# Altium project Radio Messenger.PrjPcb
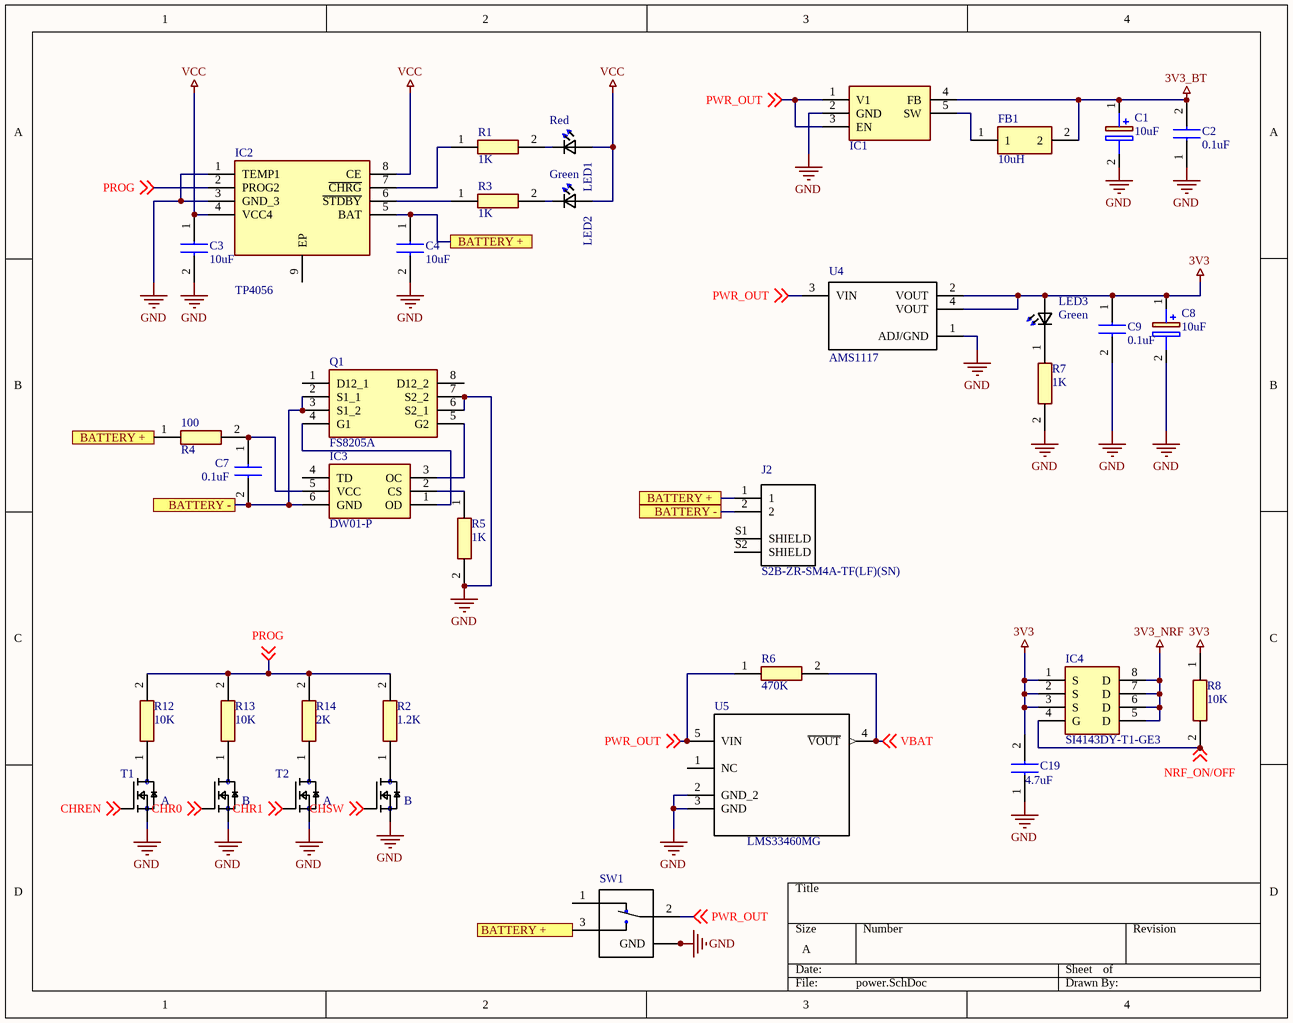
[diagram p0: power.SchDoc]
2 sheets, 51 parts. Net scope: flat (ports and power ports of the same name join across sheets).
Board file: Radio PCB.PcbDoc
Sheets:
  power.SchDoc
  Radio.SchDoc

## Sheet power.SchDoc: Power Schematic
size A; DrawnBy: Pramod Sandaruwan; DocumentNumber: 1; Revision: V3; SheetNumber: 1; SheetTotal: 5

### Parts
C1  value 10uF  [CAPPM3216X180N]  (hidden comment: tantalum capacitor 1206)
C2  value 0.1uF  [*CAPC1608X95N]  (hidden comment: capacitor 0603)
C3  value 10uF  [CAPC2012X94N]  (hidden comment: 08055A101JAT2A)
C4  value 10uF  [CAPC2012X94N]  (hidden comment: 08055A101JAT2A)
C7  value 0.1uF  [CAPC2012X94N]  (hidden comment: 08055A101JAT2A)
C8  value 10uF  [CAPPM3216X180N]  (hidden comment: tantalum capacitor 1206)
C9  value 0.1uF  [*CAPC1608X95N]  (hidden comment: capacitor 0603)
C19  value 4.7uF  [CAPC2012X94N]  (hidden comment: 08055A101JAT2A)
FB1  value 10uH  [BEADC1608X95N]  (hidden comment: inductor 0603)
IC1  TPS62203  [SOT95P280X145-5N]  (value not drawn)
IC2  TP4056  [SOIC127P600X175-9N]
IC3  DW01-P  [SOT95P280X135-6N]
IC4  SI4143DY-T1-GE3  [SI4143DY-T1-GE3]
J2  S2B-ZR-SM4A-TF(LF)(SN)  [*JST_S2B-ZR-SM4A-TF(LF)(SN)_S2B-ZR-SM4A-TF(LF)(SN)(Primary)]
LED1  value Red  [*0603]  (hidden comment: HSMR-C191)
LED2  value Green  [*0603]  (hidden comment: HSMR-C191)
LED3  value Green  [*0603]  (hidden comment: HSMR-C191)
Q1  FS8205A  [SOP65P640X120-8N]
R1  value 1K  [RESC1608X55N]  (hidden comment: resistor)
R2  value 1.2K  [RESC1608X55N]  (hidden comment: resistor)
R3  value 1K  [RESC1608X55N]  (hidden comment: resistor)
R4  value 100  [RESC2012X65N]  (hidden comment: CPF0805)
R5  value 1K  [RESC2012X65N]  (hidden comment: CPF0805)
R6  value 470K  [RESC1608X55N]  (hidden comment: resistor)
R7  value 1K  [RESC1608X55N]  (hidden comment: resistor)
R8  value 10K  [RESC2012X65N]  (hidden comment: CPF0805)
R12  value 10K  [RESC1608X55N]  (hidden comment: resistor)
R13  value 10K  [RESC1608X55N]  (hidden comment: resistor)
R14  value 2K  [RESC1608X55N]  (hidden comment: resistor)
SW1  1437575-1  [*SW_MLL1200S_MLL1200S(Primary)]  (value not drawn)
T1  PMGD780SN  [*SOP65P210X110-6N]  (value not drawn)
T2  PMGD780SN  [*SOP65P210X110-6N]  (value not drawn)
U4  AMS1117  [*SOT229P700X180-4N]
U5  LMS33460MG  [*SOT65P210X110-5N]

### Ports
BATTERY +, BATTERY -

### Nets
3V3: C8.1(+) C9.1 C19.2 IC4.1(S) IC4.2(S) IC4.3(S) LED3.2(A2) R8.1 U4.2(VOUT) U4.4(VOUT)
3V3_BT: C1.1(+) C2.2 FB1.2 IC1.4(FB)
3V3_NRF: IC4.5(D) IC4.6(D) IC4.7(D) IC4.8(D)
GND: C1.2(-) C2.1 C3.2 C4.2 C8.2(-) C9.2 C19.1 IC1.2(GND) IC2.1(TEMP1) IC2.3(GND_3) Q1.6(S2_1) Q1.7(S2_2) R5.2 R7.2 SW1.G1(GND) SW1.G2(GND) SW1.G3(GND) SW1.G4(GND) T1.1(S) T1.4(S) T2.1(S) T2.4(S) U4.1(ADJ/GND) U5.2(GND_2) U5.3(GND)
VCC: C3.1 IC2.4(VCC4) IC2.8(CE) LED1.2(A2) LED2.2(A2)
CHR0: T1.5(G) ; off-sheet CHR0
CHR1: T2.2(G) ; off-sheet CHR1
CHREN: T1.2(G) ; off-sheet CHREN
CHSW: T2.5(G) ; off-sheet CHSW
NRF_ON/OFF: IC4.4(G) R8.2 ; off-sheet NRF_ON/OFF
PROG: IC2.2(PROG2) R2.2 R12.2 R13.2 R14.2 ; off-sheet PROG
PWR_OUT: IC1.1(V1) IC1.3(EN) R6.1 SW1.2 U4.3(VIN) U5.5(VIN) ; off-sheet PWR_OUT
VBAT: R6.2 U5.4(~{VOUT}) ; off-sheet VBAT
NetC4_1: C4.1 IC2.5(BAT) J2.1 R4.1 SW1.3 ; port BATTERY +
NetC7_1: C7.1 IC3.5(VCC) R4.2
NetC7_2: C7.2 IC3.6(GND) J2.2 Q1.2(S1_1) Q1.3(S1_2) ; port BATTERY -
NetFB1_1: FB1.1 IC1.5(SW)
NetIC2_6: IC2.6(~{STDBY}) R3.1
NetIC2_7: IC2.7(~{CHRG}) R1.1
NetIC3_1: IC3.1(OD) Q1.4(G1)
NetIC3_2: IC3.2(CS) R5.1
NetIC3_3: IC3.3(OC) Q1.5(G2)
NetLED1_1: LED1.1(K2) R1.2
NetLED2_1: LED2.1(K2) R3.2
NetLED3_1: LED3.1(K2) R7.1
NetR2_1: R2.1 T2.3(D)
NetR12_1: R12.1 T1.6(D)
NetR13_1: R13.1 T1.3(D)
NetR14_1: R14.1 T2.6(D)

Not connected (* = marked no-connect by the designer): IC2 9(EP); IC3 4(TD); J2 S1(SHIELD) S2(SHIELD); Q1 1(D12_1) 8(D12_2); SW1 1; U5 1(NC)

### Notes on the sheet
- (in symbol PMGD780SN) A; B

### Library data of the parts
C1 C8 = tantalum capacitor 1206: Capacitor Polarised
C2 C9 = capacitor 0603: Capacitor
C3 C4 C7 C19 = 08055A101JAT2A: Capacitor; Manufacturer_Name: AVX; Allied_Number: 70474488; Datasheet Link: https://componentsearchengine.com/Datasheets/1/06031A100FAT2A.pdf; Height: 0.94mm; Manufacturer_Part_Number: 08055A101JAT2A; Mouser Part Number: 581-08055A101J; Mouser Price/Stock: https://www.mouser.com/Search/Refine.aspx?Keyword=581-08055A101J; RS Part Number: 0391000P; RS Price/Stock: http://uk.rs-online.com/web/p/products/0391000P; Allied Price/Stock: https://www.alliedelec.com/avx-08055a101jat2a/70474488/
FB1 = inductor 0603: Ferrite Bead
IC1 = TPS62203: Integrated Circuit
IC2 = TP4056: Integrated Circuit; Manufacturer_Name: NanJing Top Power; Datasheet Link: https://dlnmh9ip6v2uc.cloudfront.net/datasheets/Prototyping/TP4056.pdf; Height: 1.75mm; Manufacturer_Part_Number: TP4056
IC3 = DW01-P: Integrated Circuit; Manufacturer_Name: Fortune Semiconductor Corporation; Datasheet Link: https://cdn.sparkfun.com/assets/learn_tutorials/2/5/1/DW01-P_DataSheet_V10.pdf; Height: 1.35mm; Manufacturer_Part_Number: DW01-P; ComponentLink1Description: DW01; ComponentLink1URL: https://lcsc.com/product-detail/MOSFET_DW01_C181096.html
IC4 = SI4143DY-T1-GE3: Integrated Circuit
J2 = S2B-ZR-SM4A-TF(LF)(SN): Connector Header Surface Mount, Right Angle 2 position 0.059 _1.50mm_; MF: JST Sales; MP: S2B-ZR-SM4A-TF_LF__SN_; Package: None; SnapEDA_Link: https://www.snapeda.com/parts/S2B-ZR-SM4A-TF%28LF%29%28SN%29/JST%20Sales%20America%20Inc./view-part/567593/?ref=snap; Availability: Unavailable; Price: None; Value: *
LED1-LED3 = HSMR-C191: LED Indication - Discrete 3.4V 0603 _1608 Metric_; MF: Broadcom Limited; SnapEDA_Link: https://www.snapeda.com/parts/HSMR-C191/Broadcom%20Limited/view-part/2190324/?ref=snap; Availability: Unavailable; MP: HSMR-C191; Price: None; Package: 0603 Broadcom
Q1 = FS8205A: Transistor; Manufacturer_Name: SII Semiconductor; Datasheet Link: http://www.ic-fortune.com/upload/Download/FS8205A-DS-12_EN.pdf; Height: 1.2mm; Manufacturer_Part_Number: FS8205A
R4 R5 R8 = CPF0805: Resistor; Manufacturer_Name: TE Connectivity; Manufacturer_Part_Number: CPF0805B100KE; Allied_Number: 70286772; Datasheet Link: http://docs-europe.electrocomponents.com/webdocs/13d1/0900766b813d116f.pdf; Height: 0.65mm; Mouser Part Number: 279-CPF0805B100KE; Mouser Price/Stock: https://www.mouser.com/Search/Refine.aspx?Keyword=279-CPF0805B100KE; RS Part Number: 6662673; RS Price/Stock: https://uk.rs-online.com/web/p/products/6662673; Allied Price/Stock: https://www.alliedelec.com/te-connectivity-cpf0805b100ke/70286772/
SW1 = MLL1200S: Slide Switch SPDT Surface Mount, Right Angle; MF: TE Connectivity; TE_purchase_URL: https://www.te.com/usa-en/product-1437575-1.html?te_bu=Cor&te_type=disp&te_campaign=seda_glo_cor-seda-global-disp-prtnr-fy19-seda-model-bom-cta_sma-317_1&elqCampaignId=32493; Availability: Unavailable; SnapEDA_Link: https://www.snapeda.com/parts/MLL1200S/TE%20Connectivity%20ALCOSWITCH%20Switches/view-part/1494234/?ref=snap; Price: None; MP: MLL1200S; Package: None; Value: *
T1 T2 = PMGD780SN: Mosfet Array 2 N-Channel _Dual_ 20V 1.2A 390mW Surface Mount 6-TSSOP; MF: NXP Semiconductors; Package: SOT-363 NXP Semiconductors; Price: None; MP: PMGD780SN; Availability: Unavailable; SnapEDA_Link: https://www.snapeda.com/parts/PMGD130UN/NXP%20Semiconductors/view-part/4258135/?ref=snap; Value: *
U4 = AMS1117: 1A LOW DROPOUT VOLTAGE REGULATOR; MF: Seeed Technology; MP: AMS1117; SnapEDA_Link: https://www.snapeda.com/parts/AMS1117/Seeed%20Technology%20Co.%2C%20Ltd/view-part/?ref=snap; Price: None; Package: SOT-223 Seeed Technology; Availability: Unavailable; Value: *
U5 = LMS33460MG: 3V Under Voltage Detector 5-SC70 -40 to 85; MF: Texas Instruments; MP: LMS33460MG/NOPB; Package: SC-70 Texas Instruments; Price: None; Availability: Unavailable; SnapEDA_Link: https://www.snapeda.com/parts/LMS33460MG/NOPB/Texas%20Instruments/view-part/16255/?ref=snap; Value: *

## Sheet Radio.SchDoc
size A
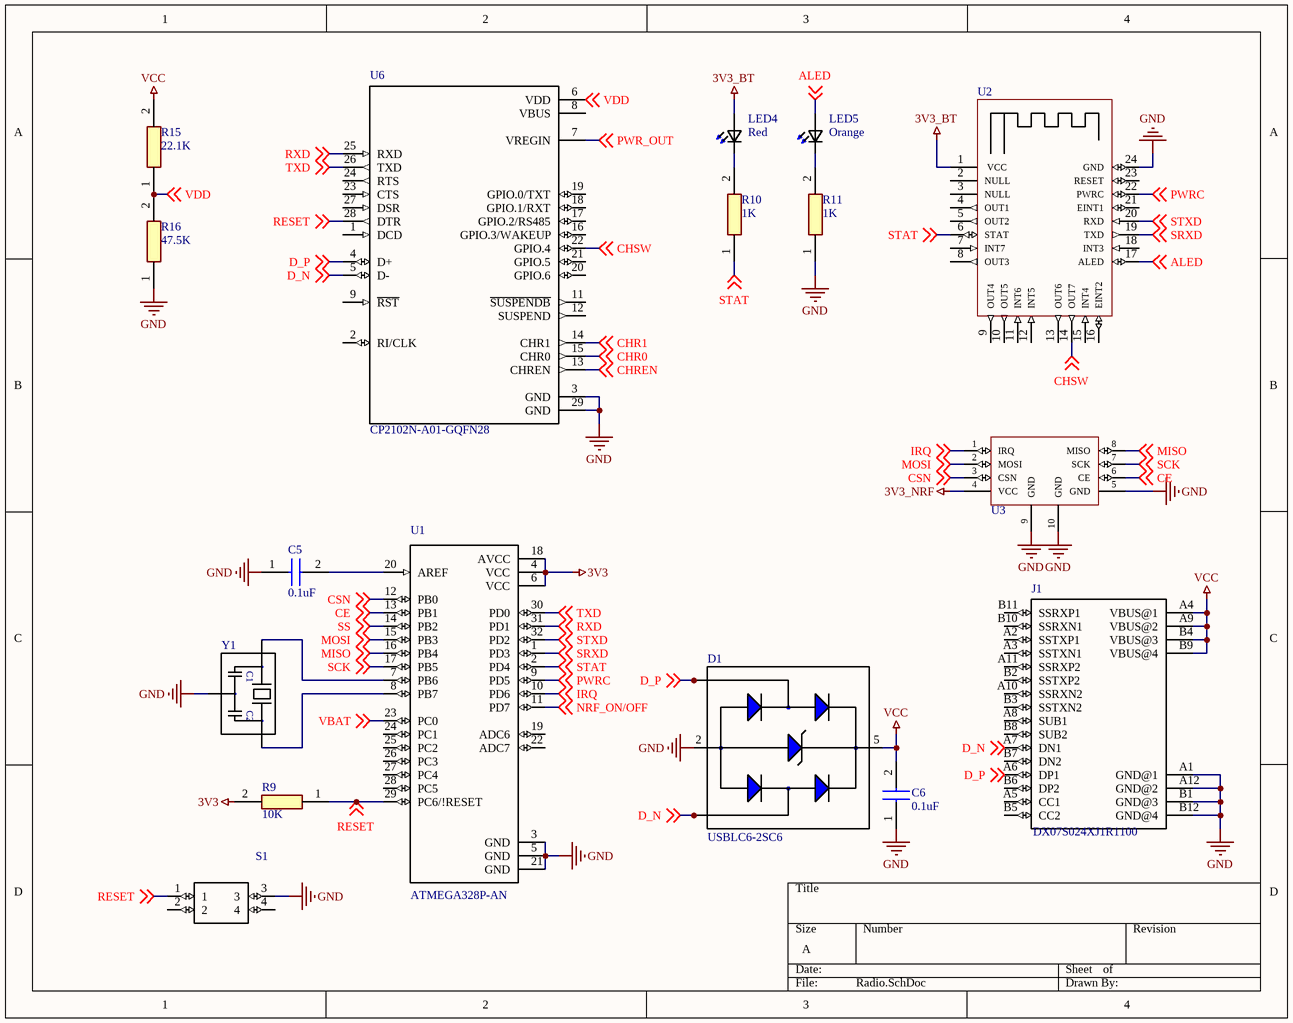
[diagram p1: Radio.SchDoc]

### Parts
C5  value 0.1uF  [*CAPC1608X95N]  (hidden comment: capacitor 0603)
C6  value 0.1uF  [*CAPC1608X95N]  (hidden comment: capacitor 0603)
D1  USBLC6-2SC6  [*SOT95P280X145-6N]
J1  DX07S024XJ1R1100  [*JAE_DX07S024XJ1R1100_DX07S024XJ1R1100(Primary)]
LED4  value Red  [*0603]  (hidden comment: HSMR-C191)
LED5  value Orange  [*0603]  (hidden comment: HSMR-C191)
R9  value 10K  [RESC1608X55N]  (hidden comment: resistor)
R10  value 1K  [RESC1608X55N]  (hidden comment: resistor)
R11  value 1K  [RESC1608X55N]  (hidden comment: resistor)
R15  value 22.1K  [RESC1608X55N]  (hidden comment: resistor)
R16  value 47.5K  [RESC1608X55N]  (hidden comment: resistor)
S1  PTS810SJK250SMTRLFS  [*PTS810SJG250SMTRLFS]  (value not drawn)
U1  ATMEGA328P-AN  [*QFP80P900X900X120-32N]
U2  JDY-23  [*JDY-23]  (value not drawn)
U3  NRF24L01P+  [NRF24L01P+]  (value not drawn)
U6  CP2102N-A01-GQFN28  [*QFN50P500X500X80-29N]
Y1  PBRC8.00MR10X000  [*XTAL_PBRC8.00MR10X000]  (value not drawn)

### Nets
3V3: R9.2 U1.4(VCC) U1.6(VCC) U1.18(AVCC)
3V3_BT: LED4.2(A2) U2.1(VCC)
3V3_NRF: U3.4(VCC)
GND: C5.1 C6.1 D1.2(GND) J1.A1(GND@1) J1.A12(GND@2) J1.B1(GND@3) J1.B12(GND@4) R11.1 R16.1 S1.3 U1.3(GND) U1.5(GND) U1.21(GND) U2.24(GND) U3.5(GND) U3.9(GND) U3.10(GND) U6.3(GND) U6.29(GND) Y1.2(GND)
VCC: C6.2 D1.5(VBUS) J1.A4(VBUS@1) J1.A9(VBUS@2) J1.B4(VBUS@3) J1.B9(VBUS@4) R15.2
ALED: LED5.2(A2) U2.17(ALED) ; off-sheet ALED
CE: U1.13(PB1) U3.6(CE) ; off-sheet CE
CHR0: U6.15(CHR0) ; off-sheet CHR0
CHR1: U6.14(CHR1) ; off-sheet CHR1
CHREN: U6.13(CHREN) ; off-sheet CHREN
CHSW: U2.14(OUT7) U6.22(GPIO.4) ; off-sheet CHSW
CSN: U1.12(PB0) U3.3(CSN) ; off-sheet CSN
D_N: D1.3(I/O2) D1.4(I/O2) J1.A7(DN1) U6.5(D-) ; off-sheet D_N
D_P: D1.1(I/O1) D1.6(I/O1) J1.A6(DP1) U6.4(D+) ; off-sheet D_P
IRQ: U1.10(PD6) U3.1(IRQ) ; off-sheet IRQ
MISO: U1.16(PB4) U3.8(MISO) ; off-sheet MISO
MOSI: U1.15(PB3) U3.2(MOSI) ; off-sheet MOSI
NRF_ON/OFF: U1.11(PD7) ; off-sheet NRF_ON/OFF
PWR_OUT: U6.7(VREGIN) ; off-sheet PWR_OUT
PWRC: U1.9(PD5) U2.22(PWRC) ; off-sheet PWRC
RESET: R9.1 S1.1 U1.29(PC6/!RESET) U6.28(DTR) ; off-sheet RESET
RXD: U1.31(PD1) U6.25(RXD) ; off-sheet RXD
SCK: U1.17(PB5) U3.7(SCK) ; off-sheet SCK
SRXD: U1.1(PD3) U2.19(TXD) ; off-sheet SRXD
SS: U1.14(PB2) ; off-sheet SS
STAT: R10.1 U1.2(PD4) U2.6(STAT) ; off-sheet STAT
STXD: U1.32(PD2) U2.20(RXD) ; off-sheet STXD
TXD: U1.30(PD0) U6.26(TXD) ; off-sheet TXD
VBAT: U1.23(PC0) ; off-sheet VBAT
VDD: R15.1 R16.2 U6.6(VDD) ; off-sheet VDD
NetC5_2: C5.2 U1.20(AREF)
NetLED4_1: LED4.1(K2) R10.2
NetLED5_1: LED5.1(K2) R11.2
NetU1_7: U1.7(PB6) Y1.1(IN)
NetU1_8: U1.8(PB7) Y1.3(OUT)

Not connected (* = marked no-connect by the designer): J1 A2(SSTXP1) A3(SSTXN1) A5(CC1) A8(SUB1) A10(SSRXN2) A11(SSRXP2) B2(SSTXP2) B3(SSTXN2) B5(CC2) B6(DP2) B7(DN2) B8(SUB2) B10(SSRXN1) B11(SSRXP1); S1 2 4; U1 19(ADC6) 22(ADC7) 24(PC1) 25(PC2) 26(PC3) 27(PC4) 28(PC5); U2 2(NULL) 3(NULL) 4(OUT1) 5(OUT2) 7(INT7) 8(OUT3) 9(OUT4) 10(OUT5) 11(INT6) 12(INT5) 13(OUT6) 15(INT4) 16(EINT2) 18(INT3) 21(EINT1) 23(RESET); U6 1(DCD) 2(RI/CLK) 8(VBUS) 9(~{RST}) 11(~{SUSPENDB}) 12(SUSPEND) 16(GPIO.3/WAKEUP) 17(GPIO.2/RS485) 18(GPIO.1/RXT) 19(GPIO.0/TXT) 20(GPIO.6) 21(GPIO.5) 23(CTS) 24(RTS) 27(DSR)

### Notes on the sheet
- (in symbol PBRC8.00MR10X000) C1; C2

### Library data of the parts
C5 C6 = capacitor 0603: Capacitor
D1 = USBLC6-2SC6: USBLC6 Series 2 Line 6 V Uni / Bi-Directional ESD Protection - SOT-23-6; MF: STMicroelectronics; Package: SOT-23-6 STMicroelectronics; Price: None; SnapEDA_Link: https://www.snapeda.com/parts/USBLC6-2SC6/STMicroelectronics/view-part/?ref=snap; MP: USBLC6-2SC6; Availability: Unavailable; Value: *
J1 = DX07S024XJ1R1100: Cut Tape - Usb Type c Receptacle Mid Mnt Dual r; MF: JAE Electronics; SnapEDA_Link: https://www.snapeda.com/parts/DX07S024XJ1R1100/JAE%20Electronics/view-part/?ref=snap; Package: None; MP: DX07S024XJ1R1100; Availability: Unavailable; Price: None; Value: *
LED4 LED5 = HSMR-C191: as LED1 on sheet power; SnapEDA_Link: https://www.snapeda.com/parts/HSMR-C191/Broadcom%20Limited/view-part/2190324/?ref=snap; Availability: Unavailable; MP: HSMR-C191; Price: None; Package: 0603 Broadcom
S1 = PTS810SJK250SMTRLFS: Tactile Switch SPST-NO Top Actuated Surface Mount; MF: C&K; MP: PTS810 SJK 250 SMTR LFS; Package: None; Availability: Unavailable; Price: None; SnapEDA_Link: https://www.snapeda.com/parts/PTS810%20SJK%20250%20SMTR%20LFS/C%26K/view-part/3076435/?ref=snap; Value: *
U1 = ATMEGA328P-AN: AVR AVRÂ® ATmega Microcontroller IC 8-Bit 20MHz 32KB _16K x 16_ FLASH 32-TQFP _7x7_; MF: Microchip; SnapEDA_Link: https://www.snapeda.com/parts/ATMEGA328P-AN/Microchip/view-part/1227245/?ref=snap; Availability: Unavailable; Price: None; Package: TQFP-32 Microchip; MP: ATMEGA328P-AN; Value: *
U2 = JDY-23: Bluetooth Bluetooth v4.0 Transceiver Module 2.4GHz Integrated, Chip Surface Mount; MF: Sierra Wireless; SnapEDA_Link: https://www.snapeda.com/parts/BC118/Sierra%20Wireless/view-part/48683/?ref=snap; Price: None; Availability: Unavailable; Package: None; MP: JDY-23; Value: *
U6 = CP2102N-A01-GQFN28: USB Bridge, USB to UART USB 2.0 UART Interface 28-QFN _5x5_; MF: Silicon Labs; Package: QFN-28 Silicon Labs; Price: None; Availability: Unavailable; MP: CP2102N-A01-GQFN28; SnapEDA_Link: https://www.snapeda.com/parts/CP2102N-A01-GQFN28/Silicon%20Labs/view-part/554799/?ref=snap; Value: *
Y1 = PBRC8.00MR10X000: 8MHz Ceramic Resonator Built in Capacitor 15pF Â±0.1% -40Â°C ~ 85Â°C Surface Mount; MF: Kyocera International; Package: SMD-3 AVX / Kyocera; MP: PBRC8.00MR10X000; SnapEDA_Link: https://www.snapeda.com/parts/PBRC8.00MR10X000/Kyocera%20International%20Inc.%20Electronic%20Components/view-part/481757/?ref=snap; Availability: Unavailable; Price: None; Value: *
U3 = NRF24L01P+: Parameter 1: *

## Nets that join several sheets
3V3: power (10 pins), Radio (R9.2 U1.4 U1.6 U1.18)
3V3_BT: power (C1.1 C2.2 FB1.2 IC1.4), Radio (LED4.2 U2.1)
3V3_NRF: power (IC4.5 IC4.6 IC4.7 IC4.8), Radio (U3.4)
GND: power (25 pins), Radio (20 pins)
VCC: power (5 pins), Radio (7 pins)
CHR0: power (T1.5), Radio (U6.15)
CHR1: power (T2.2), Radio (U6.14)
CHREN: power (T1.2), Radio (U6.13)
CHSW: power (T2.5), Radio (U2.14 U6.22)
NRF_ON/OFF: power (IC4.4 R8.2), Radio (U1.11)
PWR_OUT: power (6 pins), Radio (U6.7)
VBAT: power (R6.2 U5.4), Radio (U1.23)